# EAGLE schematic schematic (EAGLE 6.2)
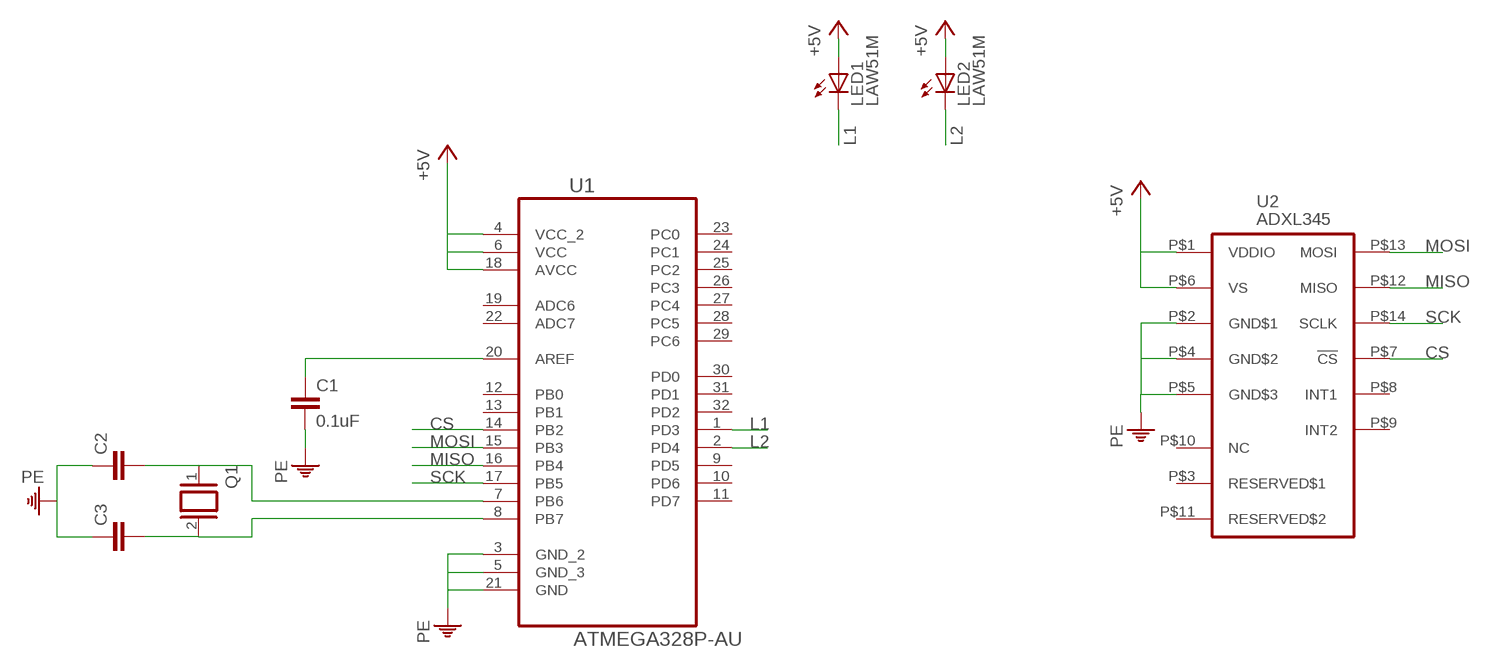
[diagram p0: schematic, sheet 1]

## Parts
C1  0.1uF  C2,5-3  [C2.5-3]
C2  C2,5-3  [C2.5-3]
C3  C2,5-3  [C2.5-3]
LED1  LAW51M  [W51]
LED2  LAW51M  [W51]
Q1  XTAL/S  [QS]
U1  ATMEGA328P-AU  [QFP80P900X900X120-32N]
U2  ADXL345  [LGA14]

## Nets
+5V: LED1.A LED2.A U1.4(VCC_2) U1.6(VCC) U1.18(AVCC) U2.P$1(VDDIO) U2.P$6(VS)
CS: U1.14(PB2) U2.P$7(!CS)
L1: LED1.C U1.1(PD3)
L2: LED2.C U1.2(PD4)
MISO: U1.16(PB4) U2.P$12(MISO)
MOSI: U1.15(PB3) U2.P$13(MOSI)
N$3: C1.1 U1.20(AREF)
N$4: C2.2 Q1.1 U1.7(PB6)
N$5: C3.2 Q1.2 U1.8(PB7)
PE: C1.2 C2.1 C3.1 U1.3(GND_2) U1.5(GND_3) U1.21(GND) U2.P$2(GND$1) U2.P$4(GND$2) U2.P$5(GND$3)
SCK: U1.17(PB5) U2.P$14(SCLK)
Unconnected: LED1.TH@1(TH) LED1.TH@2(TH) LED1.TH@3(TH) LED2.TH@1(TH) LED2.TH@2(TH) LED2.TH@3(TH) U1.9(PD5) U1.10(PD6) U1.11(PD7) U1.12(PB0) U1.13(PB1) U1.19(ADC6) U1.22(ADC7) U1.23(PC0) U1.24(PC1) U1.25(PC2) U1.26(PC3) U1.27(PC4) U1.28(PC5) U1.29(PC6) U1.30(PD0) U1.31(PD1) U1.32(PD2) U2.P$3(RESERVED$1) U2.P$8(INT1) U2.P$9(INT2) U2.P$10(NC) U2.P$11(RESERVED$2)

## Library data of the parts
C1-C3 = capacitor-wima:C: CAPACITOR naming: grid - package width
LED1 LED2 = led:*W51M: Golden DRAGON® with Lens Enhanced Thinfilm LED Source: LA_LR_LY_W51M_Pb_free[1].pdf
Q1 = special:XTAL/S: CRYSTAL
U1 = Atmel_By_element14_Batch_1-00:ATMEGA328P-AU: 8-bit Microcontroller with In-System Programmable Flash; MPN: ATMEGA328P-AU; OC_FARNELL: 1715486; OC_NEWARK: 14R4631; PACKAGE: TQFP-32; SUPPLIER: Atmel
U2 = adxl345:ADXL345: 3-Axis, ±2 g/±4 g/±8 g/±16 g Digital Accelerometer